# Altium schematic sheet MP3.SCHDOC
size B
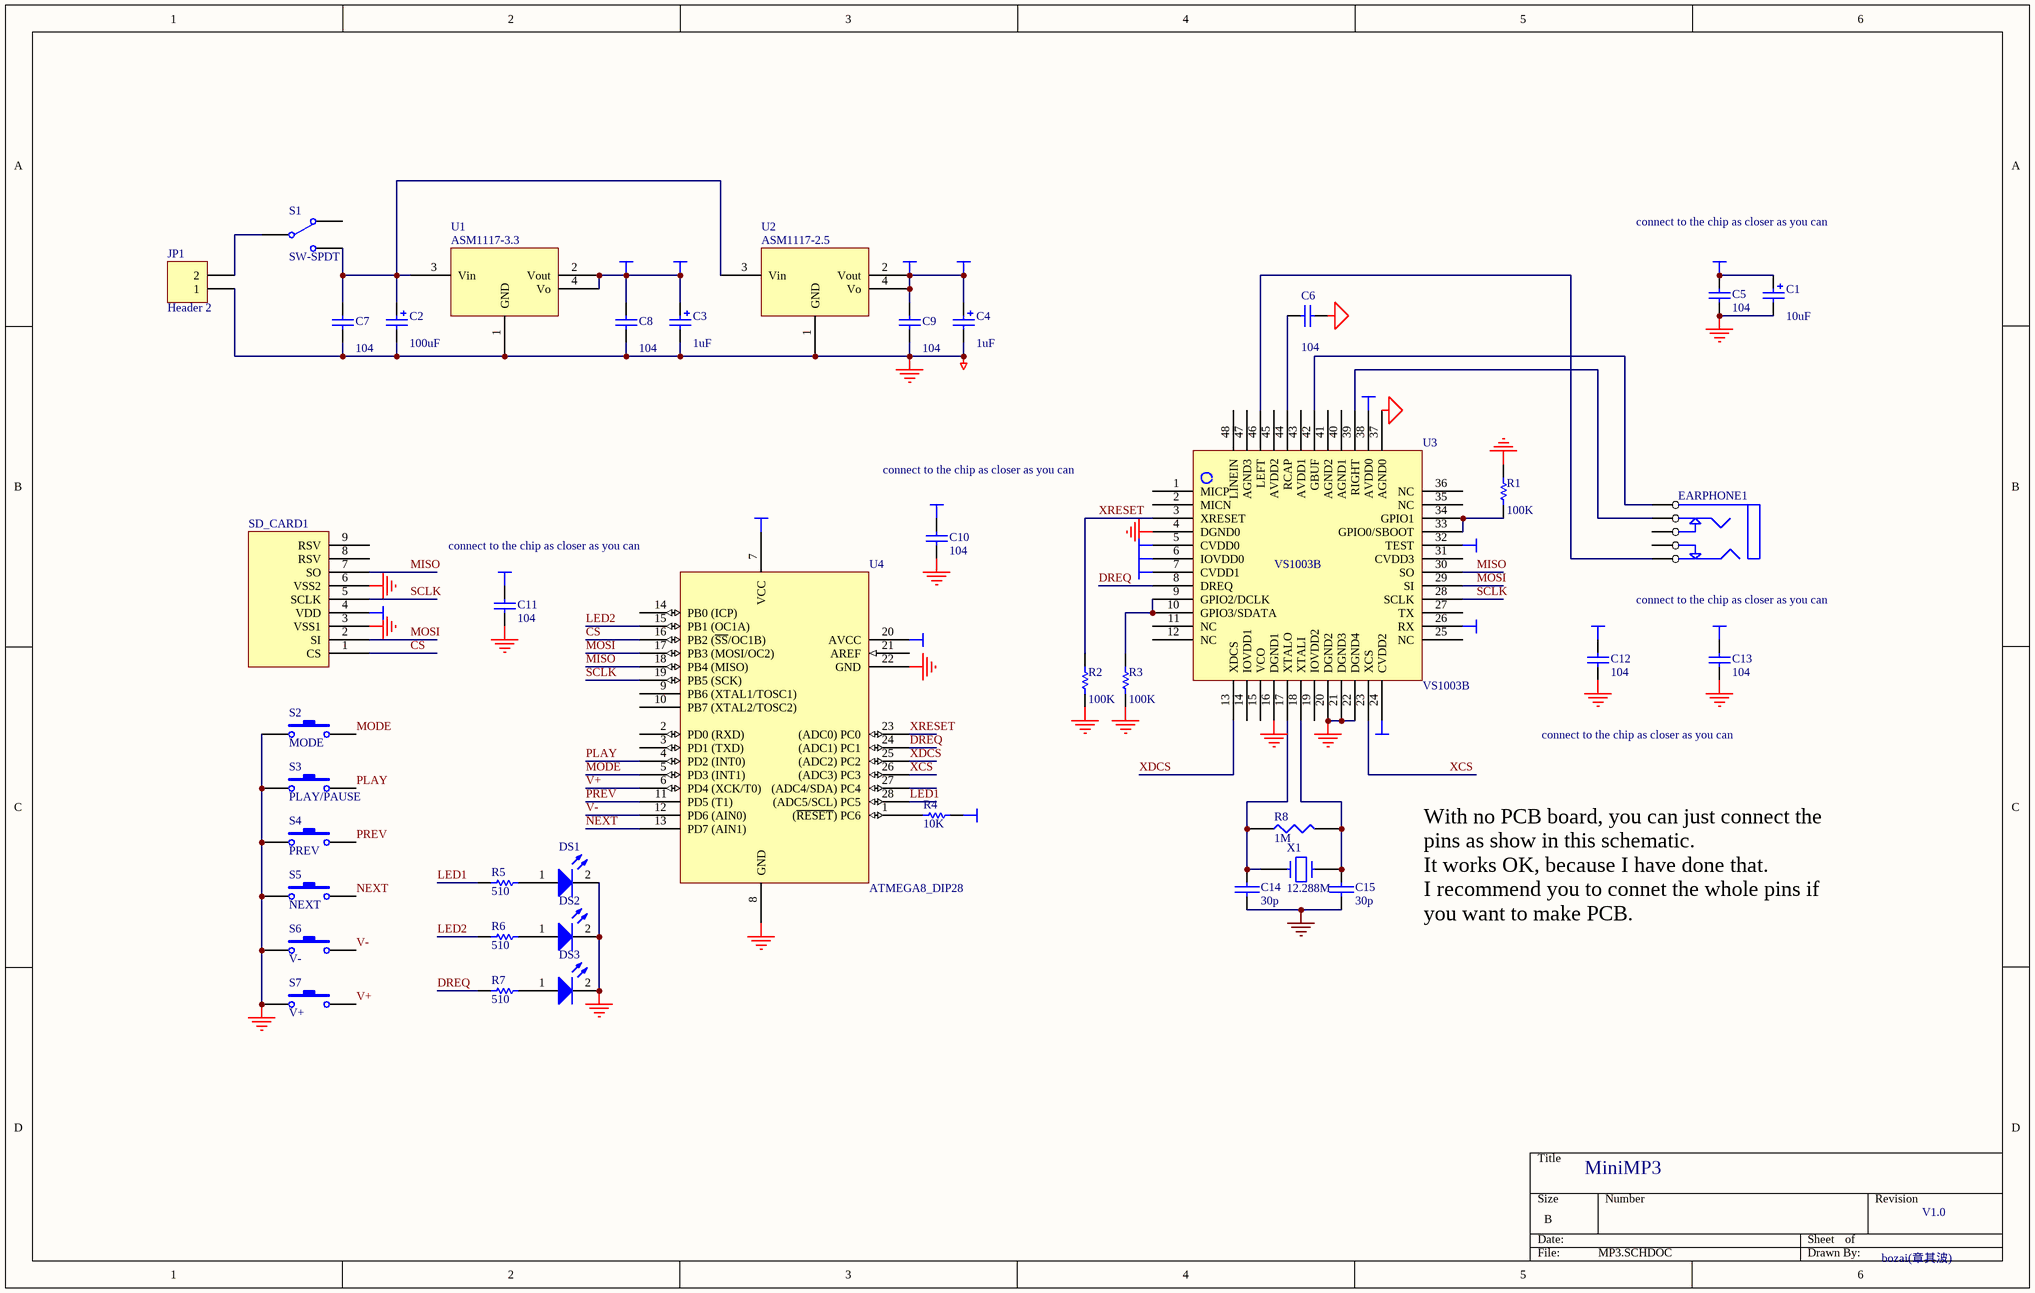
[diagram p0: MP3.SCHDOC]

## Parts
C1  value 10uF  [RB7.6-15]  (hidden comment: Cap Pol1)
C2  value 100uF  [RB7.6-15]  (hidden comment: Cap Pol1)
C3  value 1uF  [RB7.6-15]  (hidden comment: Cap Pol1)
C4  value 1uF  [RB7.6-15]  (hidden comment: Cap Pol1)
C5  value 104  [RAD-0.3]  (hidden comment: Cap)
C6  value 104  [RAD-0.3]
C7  value 104  [RAD-0.3]  (hidden comment: Cap)
C8  value 104  [RAD-0.3]  (hidden comment: Cap)
C9  value 104  [RAD-0.3]  (hidden comment: Cap)
C10  value 104  [RAD-0.3]  (hidden comment: Cap)
C11  value 104  [RAD-0.3]  (hidden comment: Cap)
C12  value 104  [RAD-0.3]  (hidden comment: Cap)
C13  value 104  [RAD-0.3]  (hidden comment: Cap)
C14  30p  [0805]
C15  30p  [0805]
DS1  (no value)  [LED-1]
DS2  (no value)  [LED-1]
DS3  (no value)  [LED-1]
EARPHONE1  (no value)  [EARHOLE]
JP1  Header 2  [HDR1X2]
R1  value 100K  [AXIAL-0.3]  (hidden comment: Res1)
R2  value 100K  [AXIAL-0.3]  (hidden comment: Res1)
R3  value 100K  [AXIAL-0.3]  (hidden comment: Res1)
R4  value 10K  [AXIAL-0.3]  (hidden comment: Res1)
R5  value 510  [AXIAL-0.3]  (hidden comment: Res1)
R6  value 510  [AXIAL-0.3]  (hidden comment: Res1)
R7  value 510  [AXIAL-0.3]  (hidden comment: Res1)
R8  1M  [0805]
S1  SW-SPDT  [SPDT-3]
S2  MODE  [SPST-2]
S3  PLAY/PAUSE  [SPST-2]
S4  PREV  [SPST-2]
S5  NEXT  [SPST-2]
S6  V-  [SPST-2]
S7  V+  [SPST-2]
SD_CARD1  (no value)  [SD_CON]
U1  ASM1117-3.3  [SOT223]
U2  ASM1117-2.5  [SOT223]
U3  VS1003B  [LQFP48]
U4  ATMEGA8_DIP28  [DIP-28]
X1  12.288M  [CRYSTAL]

## Nets
AVDD: C1.1 C4.1 C5.2 C9.2 C13.2 U2.2(Vout) U2.4(Vo) U3.5(CVDD0) U3.7(CVDD1) U3.24(CVDD2) U3.38(AVDD0)  [also labelled CVDD]
GND: C1.2 C2.2 C3.2 C4.2 C5.1 C6.1 C7.1 C8.1 C9.1 C10.1 C11.1 C12.1 C13.1 C14.2 C15.2 DS1.2(K) DS2.2(K) DS3.2(K) JP1.1 R1.2 R2.1 R3.1 S2.1 S3.1 S4.1 S5.1 S6.1 S7.1 SD_CARD1.3(VSS1) SD_CARD1.6(VSS2) U1.1(GND) U2.1(GND) U3.4(DGND0) U3.16(DGND1) U3.20(DGND2) U3.21(DGND3) U3.22(DGND4) U3.37(AGND0) U4.8(GND) U4.22(GND)
IOVDD: C3.1 C8.2 C10.2 C11.2 C12.2 R4.1 SD_CARD1.4(VDD) U1.2(Vout) U1.4(Vo) U3.6(IOVDD0) U3.26(RX) U3.32(TEST) U4.7(VCC) U4.20(AVCC)  [also labelled VCC]
CS: SD_CARD1.1(CS) U4.16(PB2_(~{SS}/OC1B))
DREQ: R7.2 U3.8(DREQ) U4.24((ADC1)_PC1)
LED1: R5.2 U4.28((ADC5/SCL)_PC5)
LED2: R6.2 U4.15(PB1_(OC1A))
MISO: SD_CARD1.7(SO) U3.30(SO) U4.18(PB4_(MISO))
MODE: S2.2 U4.5(PD3_(INT1))
MOSI: SD_CARD1.2(SI) U3.29(SI) U4.17(PB3_(MOSI/OC2))
NEXT: S5.2 U4.13(PD7_(AIN1))
PLAY: S3.2 U4.4(PD2_(INT0))
PREV: S4.2 U4.11(PD5_(T1))
SCLK: SD_CARD1.5(SCLK) U3.28(SCLK) U4.19(PB5_(SCK))
V+: S7.2 U4.6(PD4_(XCK/T0))
V-: S6.2 U4.12(PD6_(AIN0))
XCS: U3.23(XCS) U4.26((ADC3)_PC3)
XDCS: U3.13(XDCS) U4.25((ADC2)_PC2)
XRESET: R2.2 U3.3(XRESET) U4.23((ADC0)_PC0)
NetC2_1: C2.1 C7.2 S1.3(NO) U1.3(Vin) U2.3(Vin)
NetC6_2: C6.2 U3.44(RCAP)
NetC14_1: C14.1 R8.1 U3.17(XTALO) X1.2
NetC15_1: C15.1 R8.2 U3.18(XTALI) X1.1
NetDS1_1: DS1.1(A) R5.1
NetDS2_1: DS2.1(A) R6.1
NetDS3_1: DS3.1(A) R7.1
NetEARPHONE1_1: EARPHONE1.1(A) U3.46(LEFT)
NetEARPHONE1_4: EARPHONE1.4(D) U3.39(RIGHT)
NetEARPHONE1_5: EARPHONE1.5(E) U3.42(GBUF)
NetJP1_2: JP1.2 S1.1(COMMON)
NetR1_1: R1.1 U3.33(GPIO0/SBOOT) U3.34(GPIO1)
NetR3_2: R3.2 U3.9(GPIO2/DCLK) U3.10(GPIO3/SDATA)
NetR4_2: R4.2 U4.1((~{RESET})_PC6)

Not connected (* = marked no-connect by the designer): EARPHONE1 2(B) 3(C); S1 2(NC); SD_CARD1 8(RSV) 9(RSV); U3 1(MICP) 2(MICN) 11(NC) 12(NC) 14(IOVDD1) 15(VCO) 19(IOVDD2) 25(NC) 27(TX) 31(CVDD3) 35(NC) 36(NC) 40(AGND1) 41(AGND2) 43(AVDD1) 45(AVDD2) 47(AGND3) 48(LINEIN); U4 2(PD0_(RXD)) 3(PD1_(TXD)) 9(PB6_(XTAL1/TOSC1)) 10(PB7_(XTAL2/TOSC2)) 14(PB0_(ICP)) 21(AREF) 27((ADC4/SDA)_PC4)

## Notes on the sheet
- connect to the chip as closer as you can
- (near U4) connect to the chip as closer as you can
- With no PCB board, you can just connect the pins as show in this schematic.
  It works OK, because I have done that.
  I recommend you to connet the whole pins if you want to make PCB.
- MiniMP3
- V1.0
- bozai(章其波)

## Library data of the parts
C1-C4 = Cap Pol1: Polarized Capacitor (Radial); Manufacturer: Generic Components; Class: Passive; Published: 08/06/2000; Publisher: Altium Hobart Technology Centre; SubClass: Capacitor
C5-C13 = Cap: Capacitor; Manufacturer: Generic Components; Class: Passive; Published: 08/06/2000; Publisher: Altium Hobart Technology Centre; SubClass: Capacitor
C14 C15 = CAP: Capacitor
DS1-DS3 = LED1: Typical RED GaAs LED; Manufacturer: Generic Components; Class: Optoelectronic; Published: 08/06/2000; Publisher: Altium Hobart Technology Centre; SubClass: LED
EARPHONE1 = MIC
JP1 = Header 2: Header, 2-Pin; Manufacturer: Generic Components; Class: Connector
R1-R7 = Res1: Resistor; Manufacturer: Generic Components; Class: Passive; Published: 08/06/2000; Publisher: Altium Hobart Technology Centre; SubClass: Resistor
R8 = RES1
S1 = SW-SPDT: Single-Pole, Double-Throw Switch; Manufacturer: Generic Components; Published: 1999
S2-S7 = SW-PB: Switch; Manufacturer: Generic Components; Published: 1999
SD_CARD1 = SD_SPI
U1 U2 = LM1084
U3 = ST
U4 = ATMEGA8_DIP28: Atmel Microcontroller - Library created by carel..  <www.mpfreezone.com>; Part Field 1: *; Part Field 2: *; Part Field 3: *; Part Field 4: *; Part Field 5: *; Part Field 6: *; Part Field 7: *; Part Field 8: *; Part Field 9: *; Part Field 10: *; Part Field 11: *; Part Field 12: *; Part Field 13: *; Part Field 14: *; Part Field 15: *; Part Field 16: *
X1 = CRYSTAL